# EAGLE design ExpAdapter (EAGLE 9.6.2)
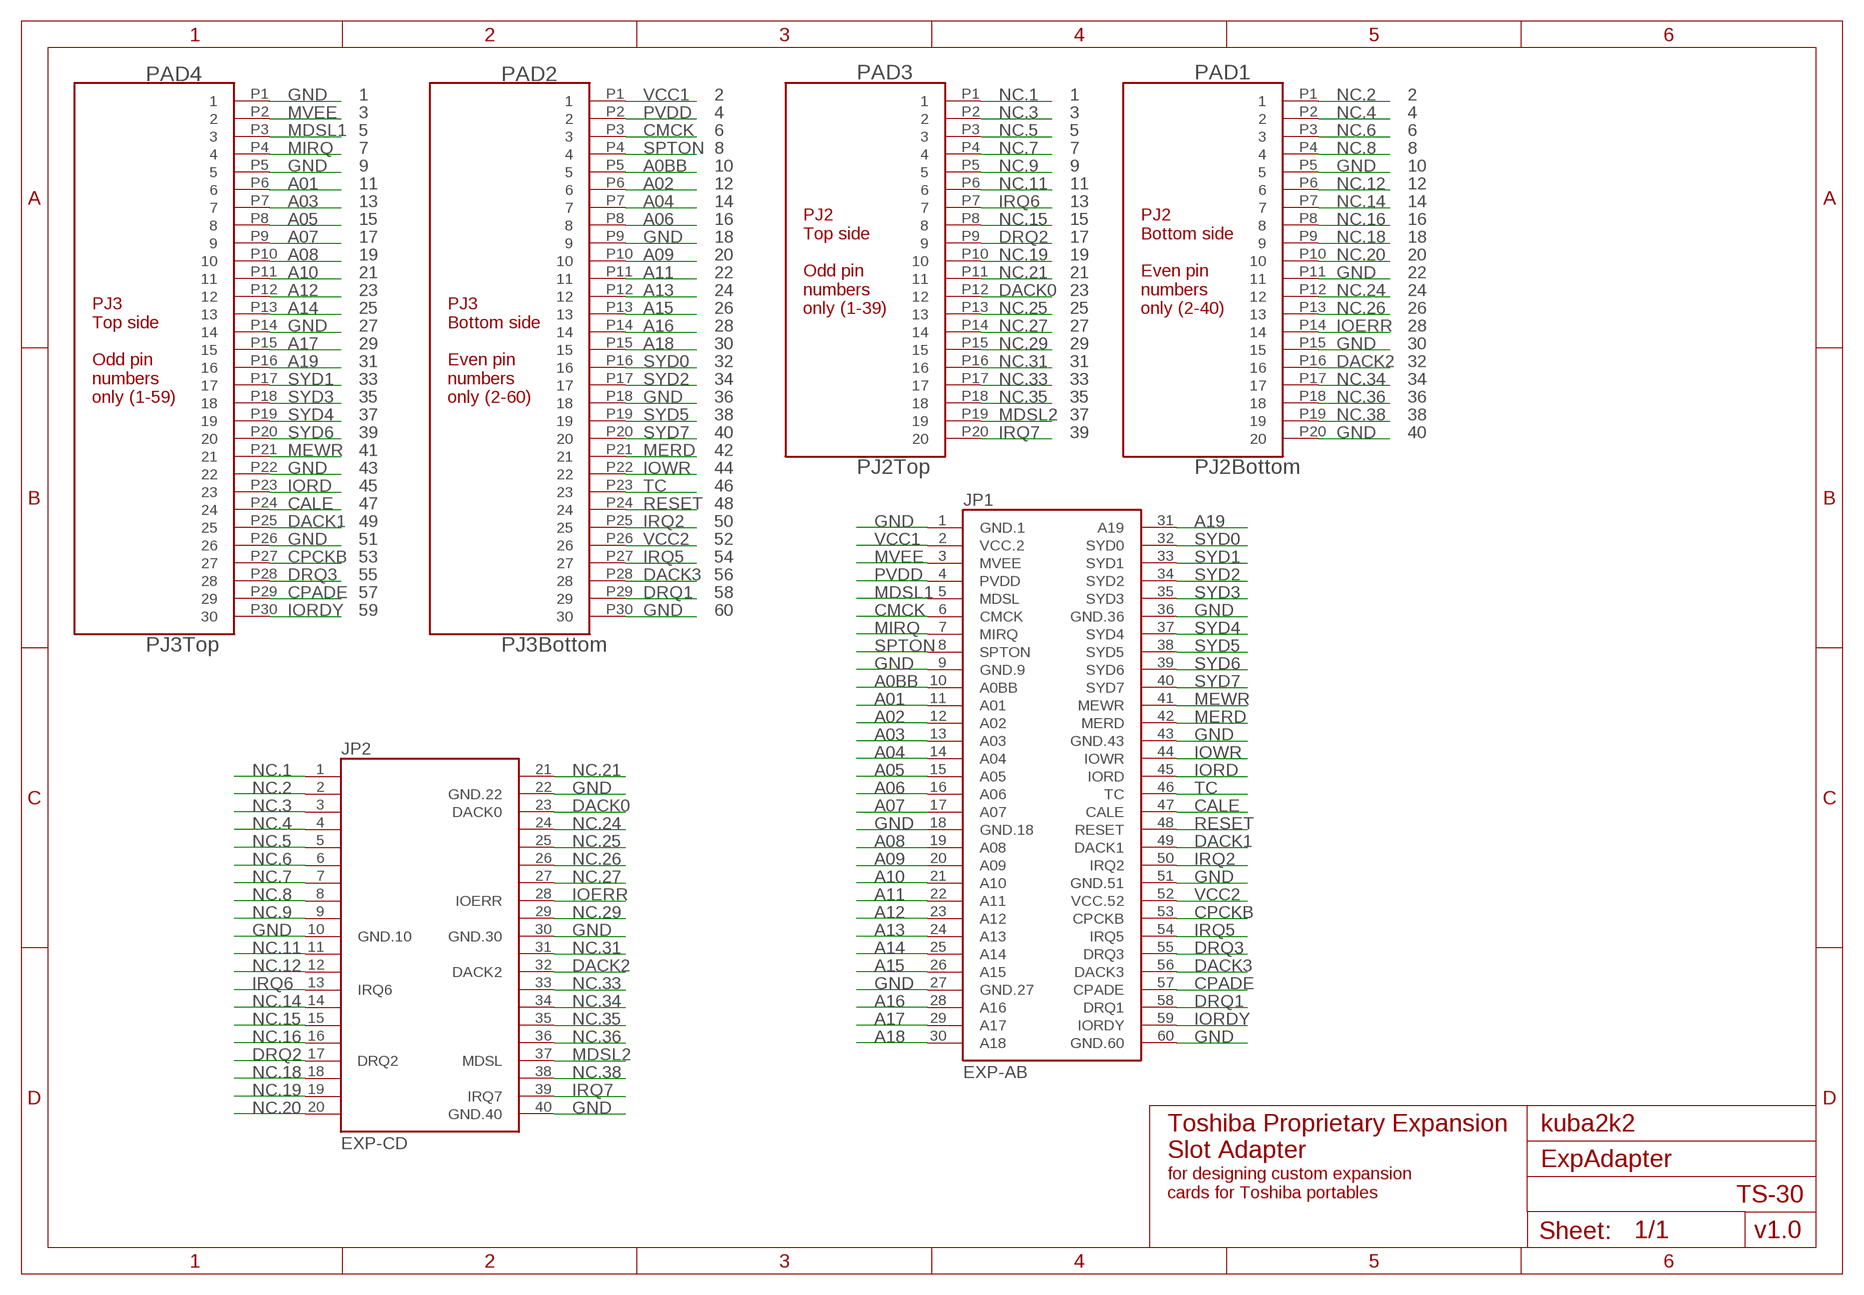
[diagram p0: schematic, sheet 1]

## Parts
JP1  EXP-AB  [CONN60]
JP2  EXP-CD  [CONN40]
PAD1  PJ2Bottom  PAD20  [PAD20]
PAD2  PJ3Bottom  PAD30  [PAD30]
PAD3  PJ2Top  PAD20  [PAD20]
PAD4  PJ3Top  PAD30  [PAD30]

## Nets
A0BB: JP1.10(A0BB) PAD2.P5
A01: JP1.11(A01) PAD4.P6
A02: JP1.12(A02) PAD2.P6
A03: JP1.13(A03) PAD4.P7
A04: JP1.14(A04) PAD2.P7
A05: JP1.15(A05) PAD4.P8
A06: JP1.16(A06) PAD2.P8
A07: JP1.17(A07) PAD4.P9
A08: JP1.19(A08) PAD4.P10
A09: JP1.20(A09) PAD2.P10
A10: JP1.21(A10) PAD4.P11
A11: JP1.22(A11) PAD2.P11
A12: JP1.23(A12) PAD4.P12
A13: JP1.24(A13) PAD2.P12
A14: JP1.25(A14) PAD4.P13
A15: JP1.26(A15) PAD2.P13
A16: JP1.28(A16) PAD2.P14
A17: JP1.29(A17) PAD4.P15
A18: JP1.30(A18) PAD2.P15
A19: JP1.31(A19) PAD4.P16
CALE: JP1.47(CALE) PAD4.P24
CMCK: JP1.6(CMCK) PAD2.P3
CPADE: JP1.57(CPADE) PAD4.P29
CPCKB: JP1.53(CPCKB) PAD4.P27
DACK0: JP2.23(DACK0) PAD3.P12
DACK1: JP1.49(DACK1) PAD4.P25
DACK2: JP2.32(DACK2) PAD1.P16
DACK3: JP1.56(DACK3) PAD2.P28
DRQ1: JP1.58(DRQ1) PAD2.P29
DRQ2: JP2.17(DRQ2) PAD3.P9
DRQ3: JP1.55(DRQ3) PAD4.P28
GND: JP1.1(GND.1) JP1.9(GND.9) JP1.18(GND.18) JP1.27(GND.27) JP1.36(GND.36) JP1.43(GND.43) JP1.51(GND.51) JP1.60(GND.60) JP2.10(GND.10) JP2.22(GND.22) JP2.30(GND.30) JP2.40(GND.40) PAD1.P5 PAD1.P11 PAD1.P15 PAD1.P20 PAD2.P9 PAD2.P18 PAD2.P30 PAD4.P1 PAD4.P5 PAD4.P14 PAD4.P22 PAD4.P26
IOERR: JP2.28(IOERR) PAD1.P14
IORD: JP1.45(IORD) PAD4.P23
IORDY: JP1.59(IORDY) PAD4.P30
IOWR: JP1.44(IOWR) PAD2.P22
IRQ2: JP1.50(IRQ2) PAD2.P25
IRQ5: JP1.54(IRQ5) PAD2.P27
IRQ6: JP2.13(IRQ6) PAD3.P7
IRQ7: JP2.39(IRQ7) PAD3.P20
MDSL1: JP1.5(MDSL) PAD4.P3
MDSL2: JP2.37(MDSL) PAD3.P19
MERD: JP1.42(MERD) PAD2.P21
MEWR: JP1.41(MEWR) PAD4.P21
MIRQ: JP1.7(MIRQ) PAD4.P4
MVEE: JP1.3(MVEE) PAD4.P2
NC.1: JP2.1(NC.1) PAD3.P1
NC.2: JP2.2(NC.2) PAD1.P1
NC.3: JP2.3(NC.3) PAD3.P2
NC.4: JP2.4(NC.4) PAD1.P2
NC.5: JP2.5(NC.5) PAD3.P3
NC.6: JP2.6(NC.6) PAD1.P3
NC.7: JP2.7(NC.7) PAD3.P4
NC.8: JP2.8(NC.8) PAD1.P4
NC.9: JP2.9(NC.9) PAD3.P5
NC.11: JP2.11(NC.11) PAD3.P6
NC.12: JP2.12(NC.12) PAD1.P6
NC.14: JP2.14(NC.14) PAD1.P7
NC.15: JP2.15(NC.15) PAD3.P8
NC.16: JP2.16(NC.16) PAD1.P8
NC.18: JP2.18(NC.18) PAD1.P9
NC.19: JP2.19(NC.19) PAD3.P10
NC.20: JP2.20(NC.20) PAD1.P10
NC.21: JP2.21(NC.21) PAD3.P11
NC.24: JP2.24(NC.24) PAD1.P12
NC.25: JP2.25(NC.25) PAD3.P13
NC.26: JP2.26(NC.26) PAD1.P13
NC.27: JP2.27(NC.27) PAD3.P14
NC.29: JP2.29(NC.29) PAD3.P15
NC.31: JP2.31(NC.31) PAD3.P16
NC.33: JP2.33(NC.33) PAD3.P17
NC.34: JP2.34(NC.34) PAD1.P17
NC.35: JP2.35(NC.35) PAD3.P18
NC.36: JP2.36(NC.36) PAD1.P18
NC.38: JP2.38(NC.38) PAD1.P19
PVDD [12mil]: JP1.4(PVDD) PAD2.P2
RESET: JP1.48(RESET) PAD2.P24
SPTON: JP1.8(SPTON) PAD2.P4
SYD0: JP1.32(SYD0) PAD2.P16
SYD1: JP1.33(SYD1) PAD4.P17
SYD2: JP1.34(SYD2) PAD2.P17
SYD3: JP1.35(SYD3) PAD4.P18
SYD4: JP1.37(SYD4) PAD4.P19
SYD5: JP1.38(SYD5) PAD2.P19
SYD6: JP1.39(SYD6) PAD4.P20
SYD7: JP1.40(SYD7) PAD2.P20
TC: JP1.46(TC) PAD2.P23
VCC1 [12mil]: JP1.2(VCC.2) PAD2.P1
VCC2 [12mil]: JP1.52(VCC.52) PAD2.P26

## Notes on the sheet
- 1 | 2 | 1 | 2
- 3 | 4 | 3 | 4
- 5 | 6 | 5 | 6
- 7 | 8 | 7 | 8
- 9 | 10 | 9 | 10
- 11 | 12 | 11 | 12
- 13 | 14 | 13 | 14
- 15 | 16 | 15 | 16
- 17 | 18 | 17 | 18
- 19 | 20 | 19 | 20
- 21 | 22 | 21 | 22
- 23 | 24 | 23 | 24
- 25 | 26
- PJ2
  Top side
  
  Odd pin
  numbers
  only (1-39)
- 25
- PJ2
  Bottom side
  
  Even pin
  numbers
  only (2-40)
- 26
- 27 | 28 | 27 | 28
- 29 | 30 | 29 | 30
- 31 | 32 | 31 | 32
- 33 | 34 | 33 | 34
- PJ3
  Top side
  
  Odd pin
  numbers
  only (1-59)
- 35
- PJ3
  Bottom side
  
  Even pin
  numbers
  only (2-60)
- 36 | 35 | 36
- 37 | 38 | 37 | 38
- 39 | 40 | 39 | 40
- 41 | 42
- 43 | 44
- 45 | 46
- 47 | 48
- 49 | 50
- 51 | 52
- 53 | 54
- 55 | 56
- 57 | 58
- 59 | 60
- Toshiba Proprietary Expansion
  Slot Adapter
- kuba2k2
- for designing custom expansion
  cards for Toshiba portables
- TS-30
- v1.0

## Library data of the parts
JP1 = T1200:EXP-AB: Toshiba Proprietary Slot Toshiba Expansion Bus Connector (A side/B side) 60 pins / 1.27 mm pin spacing
JP2 = T1200:EXP-CD: Toshiba Proprietary Slot Toshiba Expansion Bus Connector (C side/D side) 40 pins / 1.27 mm pin spacing
PAD1 = T1200:PAD20: 20-pin connector pad array. Pad size: 0.508 x 7.5 mm.; INFO: 20-pin connector
PAD2 = T1200:PAD30: 30-pin connector pad array. Pad size: 0.508 x 7.5 mm.
PAD3 = T1200:PAD20: 20-pin connector pad array. Pad size: 0.508 x 7.5 mm.; INFO: 20-pin connector<br>
PAD4 = T1200:PAD30: 30-pin connector pad array. Pad size: 0.508 x 7.5 mm.; INFO1: dssfsfsd

## Net classes
1 12mil: width 0.305 mm

## Board
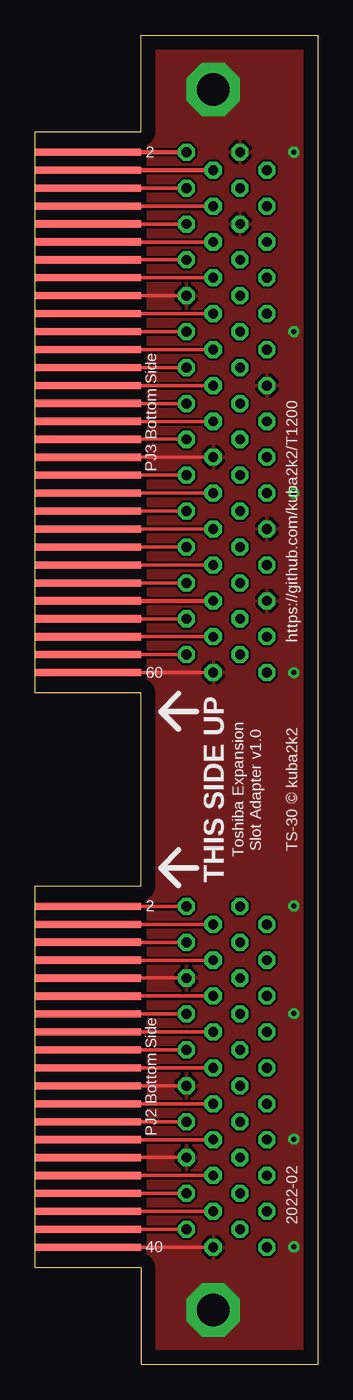
[diagram p1: board, top side]
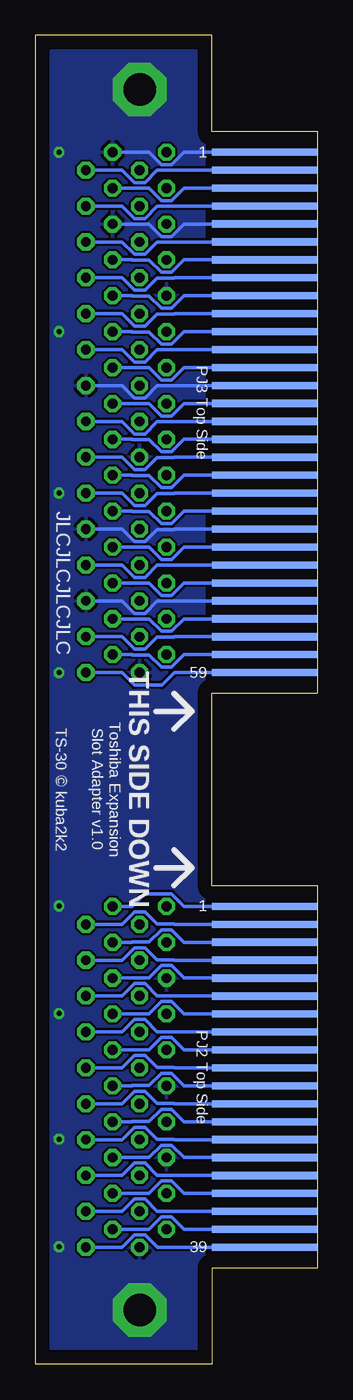
[diagram p2: board, bottom side, seen from below]

Size 20 x 94.04 mm. Coordinates in mm from the lower left corner, seen from the top.
Outline: 0,6.83 0,33.84 7.5,33.84 7.5,47.51 0,47.51 0,87.2 7.5,87.2 7.5,94.04 20,94.04 20,0 7.5,0 7.5,6.83 0,6.83
Copper layers (1*16): Top 0.035mm / dielectric 1.5mm / Bottom 0.035mm
Design rules "default *": minimum track width 6mil, minimum drill 0.35mm, track to track 6mil, track to pad 6mil, pad to pad 6mil, via to via 6mil, smd to smd 6mil, copper to edge 40mil, drill to drill 6mil, minimum pad ring 10mil, minimum via ring 8mil, stop-mask expansion 4mil, vias tented up to drill 16mil, thermal gap 10mil

### Footprints (pad centres in the part's own frame; a part is rotated, then mirrored left to right if it is on the bottom)
CONN60 = drill 0.7 octagon: 1 -18.415,0.953; 2 -18.415,-2.857; 3 -17.145,2.857; 4 -17.145,-0.953; 5 -15.875,0.953; 6 -15.875,-2.857; 7 -14.605,2.857; 8 -14.605,-0.953; 9 -13.335,0.953; 10 -13.335,-2.857; 11 -12.065,2.857; 12 -12.065,-0.953; 13 -10.795,0.953; 14 -10.795,-2.857; 15 -9.525,2.857; 16 -9.525,-0.953; 17 -8.255,0.953; 18 -8.255,-2.857; 19 -6.985,2.857; 20 -6.985,-0.953; 21 -5.715,0.953; 22 -5.715,-2.857; 23 -4.445,2.857; 24 -4.445,-0.953; 25 -3.175,0.953; 26 -3.175,-2.857; 27 -1.905,2.857; 28 -1.905,-0.953; 29 -0.635,0.953; 30 -0.635,-2.857; 31 0.635,2.857; 32 0.635,-0.953; 33 1.905,0.953; 34 1.905,-2.857; 35 3.175,2.857; 36 3.175,-0.953; 37 4.445,0.953; 38 4.445,-2.857; 39 5.715,2.857; 40 5.715,-0.953; 41 6.985,0.953; 42 6.985,-2.857; 43 8.255,2.857; 44 8.255,-0.953; 45 9.525,0.953; 46 9.525,-2.857; 47 10.795,2.857; 48 10.795,-0.953; 49 12.065,0.953; 50 12.065,-2.857; 51 13.335,2.857; 52 13.335,-0.953; 53 14.605,0.953; 54 14.605,-2.857; 55 15.875,2.857; 56 15.875,-0.953; 57 17.145,0.953; 58 17.145,-2.857; 59 18.415,2.857; 60 18.415,-0.953
CONN40 = drill 0.7 octagon: 1 -12.065,0.953; 2 -12.065,-2.857; 3 -10.795,2.857; 4 -10.795,-0.953; 5 -9.525,0.953; 6 -9.525,-2.857; 7 -8.255,2.857; 8 -8.255,-0.953; 9 -6.985,0.953; 10 -6.985,-2.857; 11 -5.715,2.857; 12 -5.715,-0.953; 13 -4.445,0.953; 14 -4.445,-2.857; 15 -3.175,2.857; 16 -3.175,-0.953; 17 -1.905,0.953; 18 -1.905,-2.857; 19 -0.635,2.857; 20 -0.635,-0.953; 21 0.635,0.953; 22 0.635,-2.857; 23 1.905,2.857; 24 1.905,-0.953; 25 3.175,0.953; 26 3.175,-2.857; 27 4.445,2.857; 28 4.445,-0.953; 29 5.715,0.953; 30 5.715,-2.857; 31 6.985,2.857; 32 6.985,-0.953; 33 8.255,0.953; 34 8.255,-2.857; 35 9.525,2.857; 36 9.525,-0.953; 37 10.795,0.953; 38 10.795,-2.857; 39 12.065,2.857; 40 12.065,-0.953
PAD20 = smd 7.5 x 0.508: P1 0,12.065; P2 0,10.795; P3 0,9.525; P4 0,8.255; P5 0,6.985; P6 0,5.715; P7 0,4.445; P8 0,3.175; P9 0,1.905; P10 0,0.635; P11 0,-0.635; P12 0,-1.905; P13 0,-3.175; P14 0,-4.445; P15 0,-5.715; P16 0,-6.985; P17 0,-8.255; P18 0,-9.525; P19 0,-10.795; P20 0,-12.065
PAD30 = smd 7.5 x 0.508: P1 0,18.415; P2 0,17.145; P3 0,15.875; P4 0,14.605; P5 0,13.335; P6 0,12.065; P7 0,10.795; P8 0,9.525; P9 0,8.255; P10 0,6.985; P11 0,5.715; P12 0,4.445; P13 0,3.175; P14 0,1.905; P15 0,0.635; P16 0,-0.635; P17 0,-1.905; P18 0,-3.175; P19 0,-4.445; P20 0,-5.715; P21 0,-6.985; P22 0,-8.255; P23 0,-9.525; P24 0,-10.795; P25 0,-12.065; P26 0,-13.335; P27 0,-14.605; P28 0,-15.875; P29 0,-17.145; P30 0,-18.415

### Placement (x,y rotation side)
JP1  13.56,67.36 270 top
JP2  13.56,20.34 270 top
PAD1  3.75,20.34 0 top
PAD2  3.75,67.36 0 top
PAD3  3.75,20.34 0 bottom
PAD4  3.75,67.36 0 bottom

### Tracks (layer width: path | path; a pad name or v marks a point on that pad's centre or on a via)
A0BB
  Top 0.254: PAD2.P5 JP1.10
A01
  Bottom 0.254: PAD4.P6 10.15,79.42 10.17,79.4 11.38,79.4 12.24,78.54 12.97,78.54 13.85,79.42 JP1.11
A02
  Top 0.254: PAD2.P6 JP1.12
A03
  Bottom 0.254: JP1.13 13.16,78.15 13.14,78.13 11.93,78.13 11.07,77.27 10.33,77.27 9.45,78.15 PAD4.P7
A04
  Top 0.254: PAD2.P7 JP1.14
A05
  Bottom 0.254: PAD4.P8 10.15,76.88 10.17,76.86 11.38,76.86 12.24,76 12.97,76 13.85,76.88 JP1.15
A06
  Top 0.254: PAD2.P8 JP1.16
A07
  Bottom 0.254: JP1.17 13.16,75.61 13.14,75.59 11.93,75.59 11.07,74.73 10.33,74.73 9.45,75.61 PAD4.P9
A08
  Bottom 0.254: PAD4.P10 10.15,74.34 10.17,74.32 11.38,74.32 12.24,73.46 12.97,73.46 13.85,74.34 JP1.19
A09
  Top 0.254: PAD2.P10 JP1.20
A10
  Bottom 0.254: JP1.21 13.16,73.07 13.14,73.05 11.93,73.05 11.07,72.19 10.33,72.19 9.45,73.07 PAD4.P11
A11
  Top 0.254: PAD2.P11 JP1.22
A12
  Bottom 0.254: PAD4.P12 10.15,71.8 10.17,71.78 11.38,71.78 12.24,70.92 12.97,70.92 13.85,71.8 JP1.23
A13
  Top 0.254: PAD2.P12 JP1.24
A14
  Bottom 0.254: JP1.25 13.16,70.53 13.14,70.51 11.93,70.51 11.07,69.65 10.33,69.65 9.45,70.53 PAD4.P13
A15
  Top 0.254: PAD2.P13 JP1.26
A16
  Top 0.254: PAD2.P14 JP1.28
A17
  Bottom 0.254: JP1.29 13.16,67.99 13.14,67.97 11.93,67.97 11.07,67.11 10.33,67.11 9.45,67.99 PAD4.P15
A18
  Top 0.254: PAD2.P15 JP1.30
A19
  Bottom 0.254: PAD4.P16 10.15,66.72 10.17,66.7 11.38,66.7 12.24,65.84 12.97,65.84 13.85,66.72 JP1.31
CALE
  Bottom 0.254: PAD4.P24 10.15,56.56 10.17,56.54 11.38,56.54 12.24,55.68 12.97,55.68 13.85,56.56 JP1.47
CMCK
  Top 0.254: PAD2.P3 JP1.6
CPADE
  Bottom 0.254: JP1.57 13.16,50.21 13.14,50.19 11.93,50.19 11.07,49.33 10.33,49.33 9.45,50.21 PAD4.P29
CPCKB
  Bottom 0.254: JP1.53 13.16,52.75 13.14,52.73 11.93,52.73 11.07,51.87 10.33,51.87 9.45,52.75 PAD4.P27
DACK0
  Bottom 0.254: PAD3.P12 10.15,18.43 10.17,18.45 11.38,18.45 12.24,19.31 12.97,19.31 13.85,18.43 JP2.23
DACK1
  Bottom 0.254: JP1.49 13.16,55.29 13.14,55.27 11.93,55.27 11.07,54.41 10.33,54.41 9.45,55.29 PAD4.P25
DACK2
  Top 0.254: PAD1.P16 JP2.32
DACK3
  Top 0.254: PAD2.P28 JP1.56
DRQ1
  Top 0.254: PAD2.P29 JP1.58
DRQ2
  Bottom 0.254: JP2.17 13.16,22.24 13.14,22.26 11.93,22.26 11.07,23.12 10.33,23.12 9.45,22.24 PAD3.P9
DRQ3
  Bottom 0.254: PAD4.P28 10.15,51.48 10.17,51.46 11.38,51.46 12.24,50.6 12.97,50.6 13.85,51.48 JP1.55
GND  (via drill 0.35, 2.3 pad 3.8)
  Top 0.152: 3.81,8.36 PAD1.P20 | 3.81,14.61 6.86,14.61 PAD1.P15 3.81,14.61 | 7.01,19.64 3.81,19.64 PAD1.P11 7.01,19.64 | 7.01,27.26 3.81,27.26 PAD1.P5 7.01,27.26
  Top 0.254: PAD2.P9 JP1.18 | PAD2.P18 JP1.36 | PAD2.P30 JP1.60 | PAD1.P5 JP2.10 | PAD1.P11 JP2.22 | PAD1.P15 JP2.30 | PAD1.P20 JP2.40
  Bottom 0.152: 3.81,58.96 PAD4.P22
  Bottom 0.254: PAD4.P1 9.45,85.77 10.33,84.89 11.07,84.89 11.95,85.77 JP1.1 | JP1.9 13.16,80.69 13.14,80.67 11.93,80.67 11.07,79.81 10.33,79.81 9.45,80.69 PAD4.P5 | PAD4.P14 10.15,69.26 10.17,69.24 11.38,69.24 12.24,68.38 12.97,68.38 13.85,69.26 JP1.27 | PAD4.P22 10.15,59.1 10.17,59.08 11.38,59.08 12.24,58.22 12.97,58.22 13.85,59.1 JP1.43 | PAD4.P26 10.15,54.02 10.17,54 11.38,54 12.24,53.14 12.97,53.14 13.85,54.02 JP1.51
  other vias: 18.32,48.94 18.32,61.64 18.32,73.07 18.32,32.43 18.32,8.3 18.32,85.77 18.32,24.81 18.32,15.92 12.61,90.21 12.61,3.83
  pour Bottom: 8,0 8,94.04 20,94.04 20,0
  pour Top: 20,0 20,94.04 8,94.04 8,0
IOERR
  Top 0.254: PAD1.P14 JP2.28
IORD
  Bottom 0.254: JP1.45 13.16,57.83 13.14,57.81 11.93,57.81 11.07,56.95 10.33,56.95 9.45,57.83 PAD4.P23
IORDY
  Bottom 0.254: PAD4.P30 10.15,48.94 11.03,48.06 12.97,48.06 13.85,48.94 JP1.59
IOWR
  Top 0.254: PAD2.P22 JP1.44
IRQ2
  Top 0.254: PAD2.P25 JP1.50
IRQ5
  Top 0.254: PAD2.P27 JP1.54
IRQ6
  Bottom 0.254: JP2.13 13.16,24.78 13.14,24.8 11.93,24.8 11.07,25.66 10.33,25.66 9.45,24.78 PAD3.P7
IRQ7
  Bottom 0.254: PAD3.P20 11.36,8.27 12.24,9.15 12.97,9.15 13.85,8.27 JP2.39
MDSL1
  Bottom 0.254: JP1.5 13.16,83.23 13.14,83.21 11.93,83.21 11.07,82.35 10.33,82.35 9.45,83.23 PAD4.P3
MDSL2
  Bottom 0.254: JP2.37 13.16,9.54 13.14,9.56 11.93,9.56 11.07,10.42 10.33,10.42 9.45,9.54 PAD3.P19
MERD
  Top 0.254: PAD2.P21 JP1.42
MEWR
  Bottom 0.254: JP1.41 13.16,60.37 13.14,60.35 11.93,60.35 11.07,59.49 10.33,59.49 9.45,60.37 PAD4.P21
MIRQ
  Bottom 0.254: PAD4.P4 10.15,81.96 10.17,81.94 11.38,81.94 12.24,81.08 12.97,81.08 13.85,81.96 JP1.7
MVEE
  Bottom 0.254: PAD4.P2 10.15,84.5 10.17,84.48 11.38,84.48 12.24,83.62 12.97,83.62 13.85,84.5 JP1.3
NC.1
  Bottom 0.254: JP2.1 13.16,32.4 12.28,33.28 10.33,33.28 9.45,32.4 PAD3.P1
NC.2
  Top 0.254: PAD1.P1 JP2.2
NC.3
  Bottom 0.254: PAD3.P2 10.15,31.13 10.17,31.15 11.38,31.15 12.24,32.01 12.97,32.01 13.85,31.13 JP2.3
NC.4
  Top 0.254: PAD1.P2 JP2.4
NC.5
  Bottom 0.254: JP2.5 13.16,29.86 13.14,29.88 11.93,29.88 11.07,30.74 10.33,30.74 9.45,29.86 PAD3.P3
NC.6
  Top 0.254: PAD1.P3 JP2.6
NC.7
  Bottom 0.254: PAD3.P4 10.15,28.59 10.17,28.61 11.38,28.61 12.24,29.47 12.97,29.47 13.85,28.59 JP2.7
NC.8
  Top 0.254: PAD1.P4 JP2.8
NC.9
  Bottom 0.254: JP2.9 13.16,27.32 13.14,27.34 11.93,27.34 11.07,28.2 10.33,28.2 9.45,27.32 PAD3.P5
NC.11
  Bottom 0.254: PAD3.P6 10.15,26.05 10.17,26.07 11.38,26.07 12.24,26.93 12.97,26.93 13.85,26.05 JP2.11
NC.12
  Top 0.254: PAD1.P6 JP2.12
NC.14
  Top 0.254: PAD1.P7 JP2.14
NC.15
  Bottom 0.254: PAD3.P8 10.15,23.51 10.17,23.53 11.38,23.53 12.24,24.39 12.97,24.39 13.85,23.51 JP2.15
NC.16
  Top 0.254: PAD1.P8 JP2.16
NC.18
  Top 0.254: PAD1.P9 JP2.18
NC.19
  Bottom 0.254: PAD3.P10 10.15,20.97 10.17,20.99 11.38,20.99 12.24,21.85 12.97,21.85 13.85,20.97 JP2.19
NC.20
  Top 0.254: PAD1.P10 JP2.20
NC.21
  Bottom 0.254: JP2.21 13.16,19.7 13.14,19.72 11.93,19.72 11.07,20.58 10.33,20.58 9.45,19.7 PAD3.P11
NC.24
  Top 0.254: PAD1.P12 JP2.24
NC.25
  Bottom 0.254: JP2.25 13.16,17.16 13.14,17.18 11.93,17.18 11.07,18.04 10.33,18.04 9.45,17.16 PAD3.P13
NC.26
  Top 0.254: PAD1.P13 JP2.26
NC.27
  Bottom 0.254: PAD3.P14 10.15,15.89 10.17,15.91 11.38,15.91 12.24,16.77 12.97,16.77 13.85,15.89 JP2.27
NC.29
  Bottom 0.254: JP2.29 13.16,14.62 13.14,14.64 11.93,14.64 11.07,15.5 10.33,15.5 9.45,14.62 PAD3.P15
NC.31
  Bottom 0.254: PAD3.P16 10.15,13.35 10.17,13.37 11.38,13.37 12.24,14.23 12.97,14.23 13.85,13.35 JP2.31
NC.33
  Bottom 0.254: JP2.33 13.16,12.08 13.14,12.1 11.93,12.1 11.07,12.96 10.33,12.96 9.45,12.08 PAD3.P17
NC.34
  Top 0.254: PAD1.P17 JP2.34
NC.35
  Bottom 0.254: PAD3.P18 10.15,10.81 10.17,10.83 11.38,10.83 12.24,11.69 12.97,11.69 13.85,10.81 JP2.35
NC.36
  Top 0.254: PAD1.P18 JP2.36
NC.38
  Top 0.254: PAD1.P19 JP2.38
PVDD
  Top 0.305: PAD2.P2 JP1.4
RESET
  Top 0.254: PAD2.P24 JP1.48
SPTON
  Top 0.254: PAD2.P4 JP1.8
SYD0
  Top 0.254: PAD2.P16 JP1.32
SYD1
  Bottom 0.254: JP1.33 13.16,65.45 13.14,65.43 11.93,65.43 11.07,64.57 10.33,64.57 9.45,65.45 PAD4.P17
SYD2
  Top 0.254: PAD2.P17 JP1.34
SYD3
  Bottom 0.254: PAD4.P18 10.15,64.18 10.17,64.16 11.38,64.16 12.24,63.3 12.97,63.3 13.85,64.18 JP1.35
SYD4
  Bottom 0.254: JP1.37 13.16,62.91 13.14,62.89 11.93,62.89 11.07,62.03 10.33,62.03 9.45,62.91 PAD4.P19
SYD5
  Top 0.254: PAD2.P19 JP1.38
SYD6
  Bottom 0.254: PAD4.P20 10.15,61.64 10.17,61.62 11.38,61.62 12.24,60.76 12.97,60.76 13.85,61.64 JP1.39
SYD7
  Top 0.254: PAD2.P20 JP1.40
TC
  Top 0.254: PAD2.P23 JP1.46
VCC1
  Top 0.305: PAD2.P1 JP1.2
VCC2
  Top 0.305: PAD2.P26 JP1.52

### Text on the board
tPlace: https://github.com/kuba2k2/T1200 | THIS SIDE UP | Toshiba Expansion / Slot Adapter v1.0 | TS-30 © kuba2k2 | 2022-02
bPlace: JLCJLCJLCJLC | THIS SIDE DOWN | Toshiba Expansion / Slot Adapter v1.0 | TS-30 © kuba2k2
tNames: 2 | PJ3 Bottom Side | 60 | 2 | PJ2 Bottom Side | 40
bNames: 1 | PJ3 Top Side | 59 | 1 | PJ2 Top Side | 39